# Altium schematic sheet IO.SchDoc
size A3
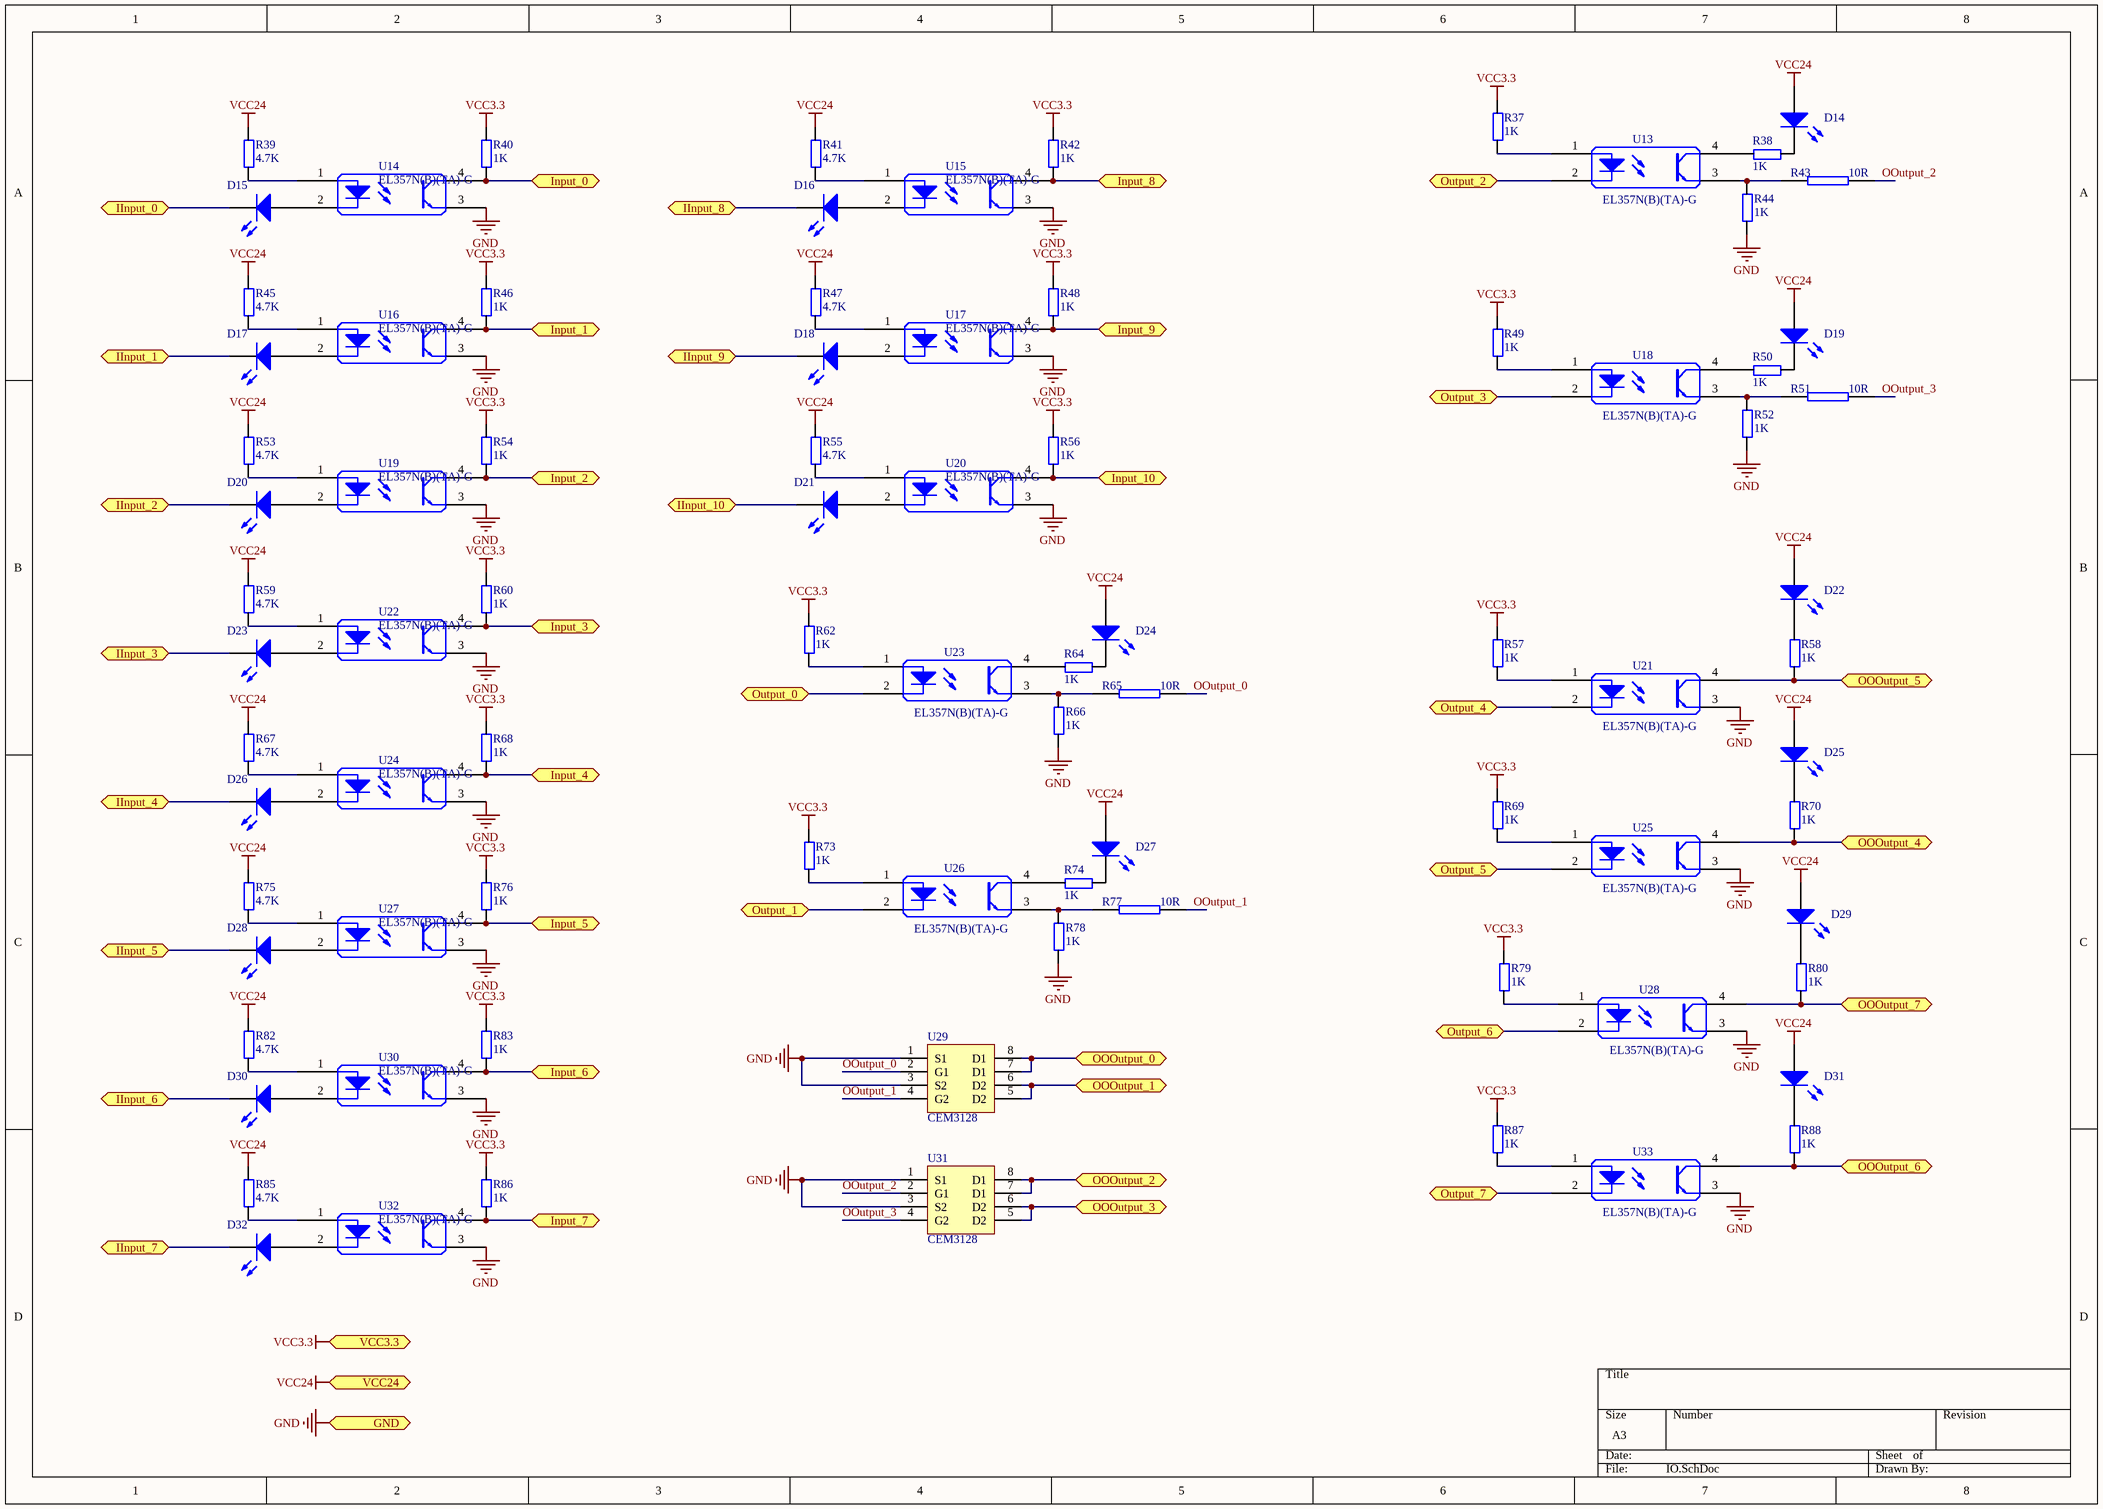
[diagram p0: IO.SchDoc]

## Parts
D14  红灯 0805  [LC-0805_LED_S1]  (value not drawn)
D15  红灯 0805  [LC-0805_LED_S1]  (value not drawn)
D16  红灯 0805  [LC-0805_LED_S1]  (value not drawn)
D17  红灯 0805  [LC-0805_LED_S1]  (value not drawn)
D18  红灯 0805  [LC-0805_LED_S1]  (value not drawn)
D19  红灯 0805  [LC-0805_LED_S1]  (value not drawn)
D20  红灯 0805  [LC-0805_LED_S1]  (value not drawn)
D21  红灯 0805  [LC-0805_LED_S1]  (value not drawn)
D22  红灯 0805  [LC-0805_LED_S1]  (value not drawn)
D23  红灯 0805  [LC-0805_LED_S1]  (value not drawn)
D24  红灯 0805  [LC-0805_LED_S1]  (value not drawn)
D25  红灯 0805  [LC-0805_LED_S1]  (value not drawn)
D26  红灯 0805  [LC-0805_LED_S1]  (value not drawn)
D27  红灯 0805  [LC-0805_LED_S1]  (value not drawn)
D28  红灯 0805  [LC-0805_LED_S1]  (value not drawn)
D29  红灯 0805  [LC-0805_LED_S1]  (value not drawn)
D30  红灯 0805  [LC-0805_LED_S1]  (value not drawn)
D31  红灯 0805  [LC-0805_LED_S1]  (value not drawn)
D32  红灯 0805  [LC-0805_LED_S1]  (value not drawn)
R37  1K  [0603_R]
R38  1K  [0603_R]
R39  4.7K  [0603_R]
R40  1K  [0603_R]
R41  4.7K  [0603_R]
R42  1K  [0603_R]
R43  10R  [0603_R]
R44  1K  [0603_R]
R45  4.7K  [0603_R]
R46  1K  [0603_R]
R47  4.7K  [0603_R]
R48  1K  [0603_R]
R49  1K  [0603_R]
R50  1K  [0603_R]
R51  10R  [0603_R]
R52  1K  [0603_R]
R53  4.7K  [0603_R]
R54  1K  [0603_R]
R55  4.7K  [0603_R]
R56  1K  [0603_R]
R57  1K  [0603_R]
R58  1K  [0603_R]
R59  4.7K  [0603_R]
R60  1K  [0603_R]
R62  1K  [0603_R]
R64  1K  [0603_R]
R65  10R  [0603_R]
R66  1K  [0603_R]
R67  4.7K  [0603_R]
R68  1K  [0603_R]
R69  1K  [0603_R]
R70  1K  [0603_R]
R73  1K  [0603_R]
R74  1K  [0603_R]
R75  4.7K  [0603_R]
R76  1K  [0603_R]
R77  10R  [0603_R]
R78  1K  [0603_R]
R79  1K  [0603_R]
R80  1K  [0603_R]
R82  4.7K  [0603_R]
R83  1K  [0603_R]
R85  4.7K  [0603_R]
R86  1K  [0603_R]
R87  1K  [0603_R]
R88  1K  [0603_R]
U13  EL357N(B)(TA)-G  [LC-SOP-4_P2.54]
U14  EL357N(B)(TA)-G  [LC-SOP-4_P2.54]
U15  EL357N(B)(TA)-G  [LC-SOP-4_P2.54]
U16  EL357N(B)(TA)-G  [LC-SOP-4_P2.54]
U17  EL357N(B)(TA)-G  [LC-SOP-4_P2.54]
U18  EL357N(B)(TA)-G  [LC-SOP-4_P2.54]
U19  EL357N(B)(TA)-G  [LC-SOP-4_P2.54]
U20  EL357N(B)(TA)-G  [LC-SOP-4_P2.54]
U21  EL357N(B)(TA)-G  [LC-SOP-4_P2.54]
U22  EL357N(B)(TA)-G  [LC-SOP-4_P2.54]
U23  EL357N(B)(TA)-G  [LC-SOP-4_P2.54]
U24  EL357N(B)(TA)-G  [LC-SOP-4_P2.54]
U25  EL357N(B)(TA)-G  [LC-SOP-4_P2.54]
U26  EL357N(B)(TA)-G  [LC-SOP-4_P2.54]
U27  EL357N(B)(TA)-G  [LC-SOP-4_P2.54]
U28  EL357N(B)(TA)-G  [LC-SOP-4_P2.54]
U29  CEM3128  [SO-8]
U30  EL357N(B)(TA)-G  [LC-SOP-4_P2.54]
U31  CEM3128  [SO-8]
U32  EL357N(B)(TA)-G  [LC-SOP-4_P2.54]
U33  EL357N(B)(TA)-G  [LC-SOP-4_P2.54]

## Ports
GND, IInput_0, IInput_1, IInput_2, IInput_3, IInput_4, IInput_5, IInput_6, IInput_7, IInput_8, IInput_9, IInput_10, Input_0, Input_1, Input_2, Input_3, Input_4, Input_5, Input_6, Input_7, Input_8, Input_9, Input_10, OOOutput_0, OOOutput_1, OOOutput_2, OOOutput_3, OOOutput_4, OOOutput_5, OOOutput_6, OOOutput_7, Output_0, Output_1, Output_2, Output_3, Output_4, Output_5, Output_6, Output_7, VCC3.3, VCC24

## Nets
GND: R44.1 R52.1 R66.1 R78.1 U14.3 U15.3 U16.3 U17.3 U19.3 U20.3 U21.3 U22.3 U24.3 U25.3 U27.3 U28.3 U29.1(S1) U29.3(S2) U30.3 U31.1(S1) U31.3(S2) U32.3 U33.3 ; port GND
VCC3.3: R37.2 R40.2 R42.2 R46.2 R48.2 R49.2 R54.2 R56.2 R57.2 R60.2 R62.2 R68.2 R69.2 R73.2 R76.2 R79.2 R83.2 R86.2 R87.2 ; port VCC3.3
VCC24: D14.A D19.A D22.A D24.A D25.A D27.A D29.A D31.A R39.2 R41.2 R45.2 R47.2 R53.2 R55.2 R59.2 R67.2 R75.2 R82.2 R85.2 ; port VCC24
IInput_0: D15.K ; port IInput_0
IInput_1: D17.K ; port IInput_1
IInput_2: D20.K ; port IInput_2
IInput_3: D23.K ; port IInput_3
IInput_4: D26.K ; port IInput_4
IInput_5: D28.K ; port IInput_5
IInput_6: D30.K ; port IInput_6
IInput_7: D32.K ; port IInput_7
IInput_8: D16.K ; port IInput_8
IInput_9: D18.K ; port IInput_9
IInput_10: D21.K ; port IInput_10
Input_0: R40.1 U14.4 ; port Input_0
Input_1: R46.1 U16.4 ; port Input_1
Input_2: R54.1 U19.4 ; port Input_2
Input_3: R60.1 U22.4 ; port Input_3
Input_4: R68.1 U24.4 ; port Input_4
Input_5: R76.1 U27.4 ; port Input_5
Input_6: R83.1 U30.4 ; port Input_6
Input_7: R86.1 U32.4 ; port Input_7
Input_8: R42.1 U15.4 ; port Input_8
Input_9: R48.1 U17.4 ; port Input_9
Input_10: R56.1 U20.4 ; port Input_10
OOOutput_0: U29.7(D1) U29.8(D1) ; port OOOutput_0
OOOutput_1: U29.5(D2) U29.6(D2) ; port OOOutput_1
OOOutput_2: U31.7(D1) U31.8(D1) ; port OOOutput_2
OOOutput_3: U31.5(D2) U31.6(D2) ; port OOOutput_3
OOOutput_4: R70.1 U25.4 ; port OOOutput_4
OOOutput_5: R58.1 U21.4 ; port OOOutput_5
OOOutput_6: R88.1 U33.4 ; port OOOutput_6
OOOutput_7: R80.1 U28.4 ; port OOOutput_7
OOutput_0: R65.1 U29.2(G1)
OOutput_1: R77.1 U29.4(G2)
OOutput_2: R43.1 U31.2(G1)
OOutput_3: R51.1 U31.4(G2)
Output_0: U23.2 ; port Output_0
Output_1: U26.2 ; port Output_1
Output_2: U13.2 ; port Output_2
Output_3: U18.2 ; port Output_3
Output_4: U21.2 ; port Output_4
Output_5: U25.2 ; port Output_5
Output_6: U28.2 ; port Output_6
Output_7: U33.2 ; port Output_7
NetD14_K: D14.K R38.2
NetD15_A: D15.A U14.2
NetD16_A: D16.A U15.2
NetD17_A: D17.A U16.2
NetD18_A: D18.A U17.2
NetD19_K: D19.K R50.2
NetD20_A: D20.A U19.2
NetD21_A: D21.A U20.2
NetD22_K: D22.K R58.2
NetD23_A: D23.A U22.2
NetD24_K: D24.K R64.2
NetD25_K: D25.K R70.2
NetD26_A: D26.A U24.2
NetD27_K: D27.K R74.2
NetD28_A: D28.A U27.2
NetD29_K: D29.K R80.2
NetD30_A: D30.A U30.2
NetD31_K: D31.K R88.2
NetD32_A: D32.A U32.2
NetR37_1: R37.1 U13.1
NetR38_1: R38.1 U13.4
NetR39_1: R39.1 U14.1
NetR41_1: R41.1 U15.1
NetR43_2: R43.2 R44.2 U13.3
NetR45_1: R45.1 U16.1
NetR47_1: R47.1 U17.1
NetR49_1: R49.1 U18.1
NetR50_1: R50.1 U18.4
NetR51_2: R51.2 R52.2 U18.3
NetR53_1: R53.1 U19.1
NetR55_1: R55.1 U20.1
NetR57_1: R57.1 U21.1
NetR59_1: R59.1 U22.1
NetR62_1: R62.1 U23.1
NetR64_1: R64.1 U23.4
NetR65_2: R65.2 R66.2 U23.3
NetR67_1: R67.1 U24.1
NetR69_1: R69.1 U25.1
NetR73_1: R73.1 U26.1
NetR74_1: R74.1 U26.4
NetR75_1: R75.1 U27.1
NetR77_2: R77.2 R78.2 U26.3
NetR79_1: R79.1 U28.1
NetR82_1: R82.1 U30.1
NetR85_1: R85.1 U32.1
NetR87_1: R87.1 U33.1

## Library data of the parts
D14-D32 = LED0: Typical INFRARED GaAs LED; Published: 8-Jun-2000; LatestRevisionDate: 08-Jul-2005; LatestRevisionNote: Mech Layer 1 removed.; PackageReference: LED-0; Publisher: Altium Limited; PackageDescription: LED; 2 Leads
R37-R42 R44-R50 R52-R60 R62 R64 R66-R70 R73-R76 R78-R80 R82 R83 R85-R88 = R_2
R43 R51 R65 R77 = RES2
U13-U28 U30 U32 U33 = 2701
U29 U31 = AF4920N